# EAGLE design random_generator_2 (EAGLE 6.1)
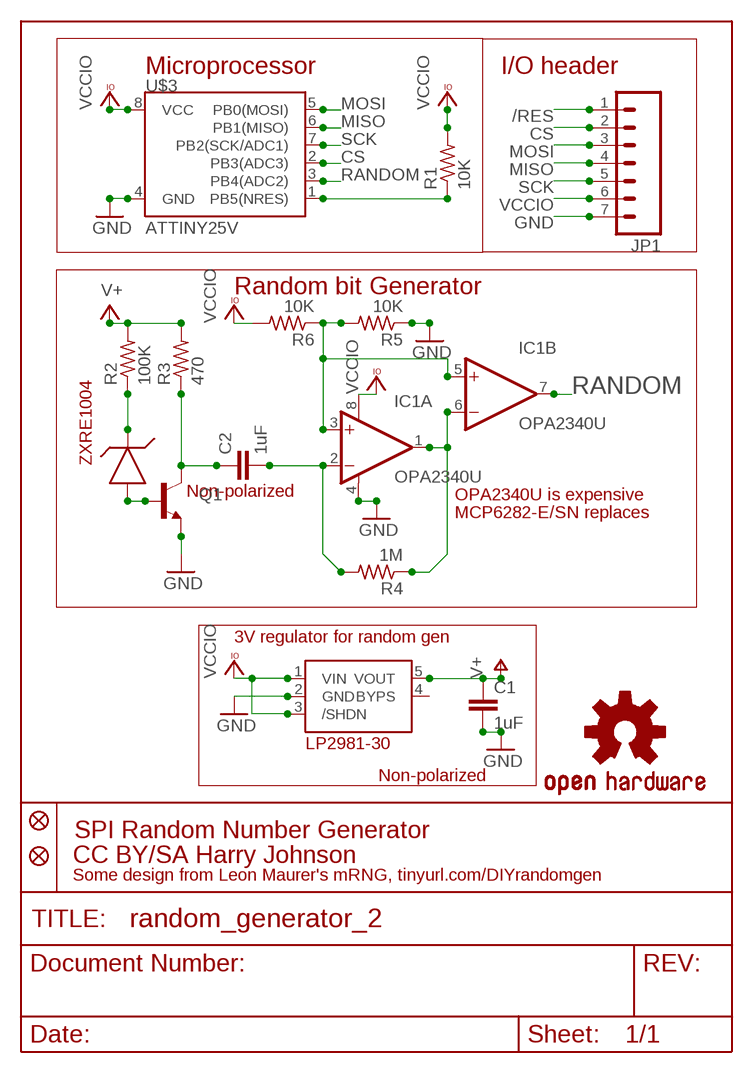
[diagram p0: schematic, sheet 1]

## Parts
C1  1uF  CAP0805  [0805]
C2  1uF  CAP0805  [0805]
IC1  OPA2340U  [SO08]
JP1  M07  [1X07]
JP2  FIDUCIALUFIDUCIAL  [MICRO-FIDUCIAL]
JP3  FIDUCIALUFIDUCIAL  [MICRO-FIDUCIAL]
Q1  TRANSISTOR_NPNSOT23  [SOT23]
R1  10K  R-US_R0805  [R0805]
R2  100K  R-US_R0805  [R0805]
R3  470  R-US_R0805  [R0805]
R4  1M  R-US_R0805  [R0805]
R5  10K  R-US_R0805  [R0805]
R6  10K  R-US_R0805  [R0805]
U$1  ZXRE1004FFTA  [SOT23]
U$2  TC1014  [SOT23-5L]
U$3  ATTINY25V  ATTINY45  [SO08-EIAJ]
U$4  OSHW-LOGOS  [OSHW-LOGO-S]

## Nets
/RES: JP1.1 R1.1 U$3.1(PB5(NRES))
CS: JP1.2 U$3.2(PB3(ADC3))
GND: C1.2 IC1.4(A:V-) JP1.7 Q1.2(E) R5.1 U$2.2(GND) U$3.4(GND)
MISO: JP1.4 U$3.6(PB1(MISO))
MOSI: JP1.3 U$3.5(PB0(MOSI))
N$2: Q1.1(B) U$1.2(A)
N$3: C2.1 Q1.3(C) R3.1
N$4: R2.1 U$1.1(K)
N$5: C2.2 IC1.2(A:-IN) R4.2
N$6: IC1.1(A:OUT) IC1.6(B:-IN) R4.1
N$8: IC1.3(A:+IN) IC1.5(B:+IN) R5.2 R6.1
RANDOM: IC1.7(B:OUT) U$3.3(PB4(ADC2))
SCK: JP1.5 U$3.7(PB2(SCK/ADC1))
V+: C1.1 R2.2 R3.2 U$2.5(VOUT)
VCCIO: IC1.8(A:V+) JP1.6 R1.2 R6.2 U$2.1(VIN) U$2.3(/SHDN) U$3.8(VCC)
Unconnected: U$2.4(BYPS)

## Notes on the sheet
- Microprocessor | I/O header
- Random bit Generator
- ZXRE1004
- Non-polarized | OPA2340U is expensive
- MCP6282-E/SN replaces
- 3V regulator for random gen
- LP2981-30
- Non-polarized
- SPI Random Number Generator
- CC BY/SA Harry Johnson
- Some design from Leon Maurer's mRNG, tinyurl.com/DIYrandomgen

## Library data of the parts
C1 C2 = SparkFun:CAP: Capacitor Standard 0603 ceramic capacitor, and 0.1" leaded capacitor.
IC1 = burr-brown:OPA2340: Single-Supply, Rail-to-Rail Operational Amplifiers MicroAmplifier(TM) Series; Product Folder:OPA2340; MF: TEXAS INSTRUMENTS; MPN: OPA2340UA; OC_FARNELL: 1101541; OC_NEWARK: 36K7581
JP1 = SparkFun:M07: Header 7 Standard 7-pin 0.1" header. Use with straight break away headers (SKU : PRT-00116), right angle break away headers (PRT-00553), swiss pins (PRT-00743), machine pins (PRT-00117), and female headers (PRT-00115). NOTES ON THE VARIANTS LOCK and LOCK_LONGPADS... This footprint was designed to help hold the alignment of a through-hole component (i.e. 7-pin header) while soldering it into place. You may notice that each hole has been shifted either up or down by 0.005 of an inch from it's more standard position (which is usually a perfectly straight line). This slight alteration caused the pins (the squares in the middle) to touch the edges of the holes. Because they are alternating, it causes a "brace" to hold the header in place. 0.005 has proven to be the perfect amount of "off-center" position when using our standard breakaway headers. Although looks a little odd when you look at the bare footprint, once you have a header in there, the alteration is very hard to notice. Also, if you push a header all the way into place, it is covered up entirely on the bottom side. This idea of altering the position of holes to aid alignment will be further integrated into the Sparkfun Library for other footprints. It can help hold any component with 3 or more connection pins.
JP2 JP3 = SparkFun:FIDUCIAL: Fiducial Alignment Points Various fiducial points for machine vision alignment.
Q1 = SparkFun:TRANSISTOR_NPN: Transistor NPN BJT configuration in SOT23 package. MMBT2222 is the common NPN we use. Double check BCE configuration again layout.
R1-R6 = adafruit:R-US_: RESISTOR, American symbol
U$1 = hjohnson_library:ZXRE1004FFTA
U$2 = hjohnson_library:TC1014
U$3 = SparkFun:ATTINY45: Atmel ATTiny45
U$4 = SparkFun:OSHW-LOGO: Open Source Hardware Logo This logo indicates the piece of hardware it is found on incorporates a OSHW license and/or adheres to the definition of open source hardware found here: http://freedomdefined.org/OSHW

## Net classes
1 power: width 0.356 mm, drill 0.406 mm, clearance 0.254 mm

## Board
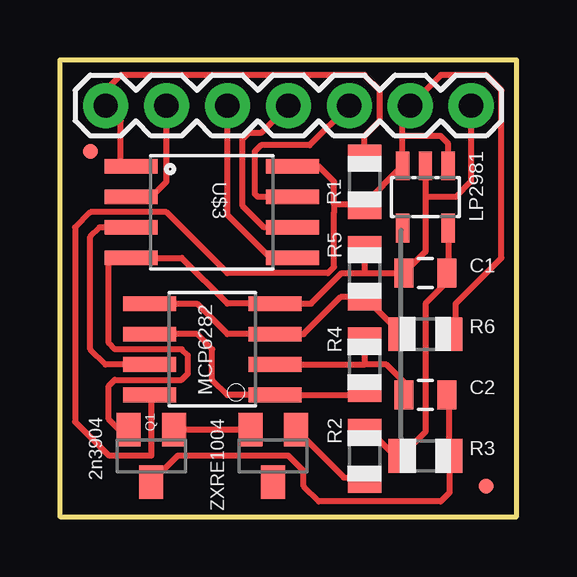
[diagram p1: board, top side]
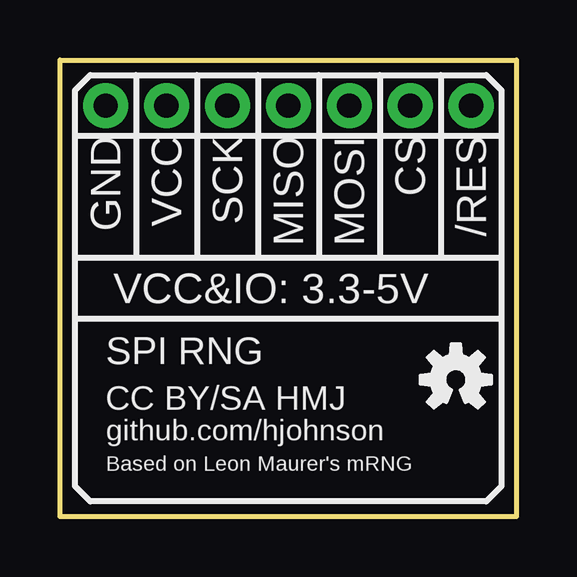
[diagram p2: board, bottom side, seen from below]

Size 19.05 x 19.05 mm. Coordinates in mm from the lower left corner, seen from the top.
Outline: 0,0 19.05,0 19.05,19.05 0,19.05 0,0
Copper layers (1*16): Top 0.0356mm / dielectric 1.5011mm / Bottom 0.0356mm
Design rules: minimum track width 6mil, minimum drill 13mil, track to track 6mil, track to pad 6mil, pad to pad 6mil, via to via 6mil, smd to smd 6mil, copper to edge 15mil, drill to drill 6mil, minimum pad ring 7mil, minimum via ring 7mil, stop-mask expansion 4mil, vias tented up to drill 0mil, thermal gap 10mil

### Footprints (pad centres in the part's own frame; a part is rotated, then mirrored left to right if it is on the bottom)
0805 = smd 0.8 x 1.2: 1 -0.9,0; 2 0.9,0
SO08 = smd 0.61 x 2.21: 1 -1.905,-2.616; 2 -0.635,-2.616; 3 0.635,-2.616; 4 1.905,-2.616; 5 1.905,2.616; 6 0.635,2.616; 7 -0.635,2.616; 8 -1.905,2.616
1X07 = drill 1.016 pad 1.88: 1 0,0; 2 2.54,0; 3 5.08,0; 4 7.62,0; 5 10.16,0; 6 12.7,0; 7 15.24,0
MICRO-FIDUCIAL = smd 0.635 x 0.635: 1 0,0
SOT23 = smd 1 x 1.4: 1 -0.95,-1.1; 2 0.95,-1.1; 3 0,1.1
R0805 = smd 1.1 x 1.4: 1 -1,0; 2 1,0
SOT23-5L = smd 0.55 x 1.2: 1 -0.95,-1.3; 2 0,-1.3; 3 0.95,-1.3; 4 0.95,1.3; 5 -0.95,1.3
SO08-EIAJ = smd 0.61 x 2.21: 1 -1.905,-3.378; 2 -0.635,-3.378; 3 0.635,-3.378; 4 1.905,-3.378; 5 1.905,3.353; 6 0.635,3.353; 7 -0.635,3.353; 8 -1.905,3.353

### Placement (x,y rotation side)
C1  15.24,10.16 180 top
C2  15.24,5.08 180 top
IC1  6.35,6.99 90 top
JP1  1.91,17.14 0 top
JP2  17.78,1.27 0 top
JP3  1.27,15.24 0 top
Q1  3.81,2.54 180 top
R1  12.7,13.97 270 top
R2  12.7,2.54 90 top
R3  15.24,2.54 180 top
R4  12.7,6.35 90 top
R5  12.7,10.16 270 top
R6  15.24,7.62 0 top
U$1  8.89,2.54 180 top
U$2  15.24,13.34 180 top
U$3  6.35,12.7 270 top
U$4  2.54,5.71 0 bottom

### Tracks (layer width: path | path; a pad name or v marks a point on that pad's centre or on a via)
/RES
  Top 0.254: 2.54,14.48 2.54,16.51 JP1.1 1.91,17.78 2.54,18.41 12.7,18.41 13.34,17.78 13.34,16.51 12.7,15.88 R1.1
  Top 0.305: U$3.1 2.67,14.61 2.54,14.48
CS
  Top 0.254: U$3.2 3.81,13.34 4.45,13.97 JP1.2
GND
  Top 0.254: Q1.2 2.46,3.64 2.03,4.06 2.03,5.46 2.29,5.71 5.08,5.71 5.33,5.97 5.33,6.73 5.08,6.99 2.29,6.99 2.03,7.24 2.03,10.67 2.16,10.79 U$3.4 5.08,10.79 6.99,8.89 IC1.4 10.48,8.89 11.75,10.16 12.7,10.16 | 12.7,10.16 C1.2 15.24,11.06 15.24,13.34 | R5.1 12.7,10.16 | U$2.2 15.24,13.34 | JP1.7 17.14,13.97 16.51,13.34 15.24,13.34
MISO
  Top 0.254: U$3.6 8.52,12.06 7.62,12.96 7.62,15.75 7.87,16 8.38,16 JP1.4
MOSI
  Top 0.254: U$3.5 8.78,10.79 6.99,12.59 JP1.3
N$2
  Top 0.254: Q1.1 U$1.2
N$3
  Top 0.254: C2.1 16.24,4.98 R3.1 16.24,1 15.88,0.64 10.79,0.64 10.16,1.27 10.16,1.91 9.53,2.54 4.91,2.54 Q1.3
N$4
  Top 0.254: U$1.1 11.84,1.64 R2.1
N$5
  Top 0.254: IC1.2 12.7,6.35 | C2.2 14.34,5.62 13.61,6.35 12.7,6.35 | R4.2 12.7,6.35
N$6
  Top 0.254: 12.44,5.71 R4.1 12.43,5.08 IC1.1 6.99,5.08 6.35,5.71 6.35,6.99 5.71,7.62 IC1.6
N$8
  Top 0.254: IC1.5 5.71,8.89 6.99,7.62 IC1.3 10.16,7.62 11.7,9.16 R5.2 R6.1
RANDOM
  Top 0.254: IC1.7 1.91,6.35 1.27,6.99 1.27,11.68 1.65,12.06 U$3.3
SCK
  Top 0.254: U$3.7 8.26,13.34 8.13,13.46 8.13,15.24 8.38,15.49 10.41,15.49 JP1.5
V+
  Top 0.254: U$2.5 16.19,10.21 C1.1 16.14,9.79 15.24,8.89 15.24,3.54 R3.2 13.97,2.54 12.97,3.54 R2.2
VCCIO
  Top 0.254: IC1.8 3.81,5.08 3.81,2.54 2.06,2.54 0.64,3.96 0.64,12.06 1.27,12.7 4.45,12.7 6.99,10.16 11.17,10.16 11.43,10.42 11.43,12.7 11.43,13.02 | R6.2 16.51,7.62 16.51,8.89 18.41,10.79 18.41,17.78 17.78,18.41 15.88,18.41 JP1.6 14.29,16.83 14.29,15.88 | U$2.1 16.19,15.56 15.88,15.88 14.29,15.88 | 14.29,15.88 U$2.3 12.7,13.04 R1.2 12.65,13.02 11.43,13.02 | 11.43,13.02 11.43,13.97 10.79,14.61 U$3.8

### Text on the board
tPlace: LP2981 | MCP6282 | 2n3904 | ZXRE1004
bPlace: /RES | CS | MOSI | MISO | SCK | VCC | GND | VCC&IO: 3.3-5V | SPI RNG | CC BY/SA HMJ | github.com/hjohnson | Based on Leon Maurer's mRNG